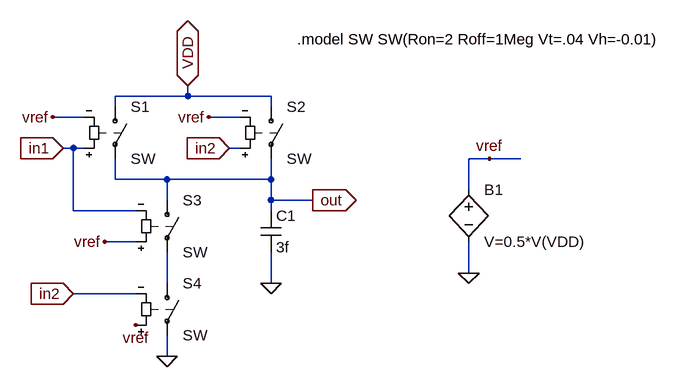
[diagram p0: schematic or2.asc]
or2.asc, the LTspice schematic file:
Version 4
SHEET 1 1084 680
WIRE 256 64 256 48
WIRE 256 64 144 64
WIRE 384 64 256 64
WIRE 144 80 144 64
WIRE 384 80 384 64
WIRE 96 96 48 96
WIRE 336 96 288 96
WIRE 80 144 64 144
WIRE 96 144 80 144
WIRE 336 144 320 144
WIRE 720 160 688 160
WIRE 768 160 720 160
WIRE 144 192 144 160
WIRE 224 192 144 192
WIRE 384 192 384 160
WIRE 384 192 224 192
WIRE 688 208 688 160
WIRE 224 224 224 192
WIRE 384 224 384 192
WIRE 448 224 384 224
WIRE 80 240 80 144
WIRE 176 240 80 240
WIRE 384 240 384 224
WIRE 176 288 128 288
WIRE 688 336 688 288
WIRE 224 352 224 304
WIRE 384 352 384 304
WIRE 176 368 80 368
WIRE 224 464 224 432
FLAG 224 464 0
FLAG 64 144 in1
IOPIN 64 144 In
FLAG 80 368 in2
IOPIN 80 368 In
FLAG 320 144 in2
IOPIN 320 144 In
FLAG 256 48 VDD
IOPIN 256 48 BiDir
FLAG 448 224 out
IOPIN 448 224 Out
FLAG 720 160 vref
FLAG 688 336 0
FLAG 176 416 vref
FLAG 128 288 vref
FLAG 48 96 vref
FLAG 288 96 vref
FLAG 384 352 0
SYMBOL sw 144 64 R0
SYMATTR InstName S1
SYMBOL sw 384 64 R0
SYMATTR InstName S2
SYMBOL sw 224 208 R0
SYMATTR InstName S3
SYMBOL sw 224 336 R0
SYMATTR InstName S4
SYMBOL bv 688 192 R0
SYMATTR InstName B1
SYMATTR Value V=0.5*V(VDD)
SYMBOL cap 368 240 R0
SYMATTR InstName C1
SYMATTR Value 3f
TEXT 424 -24 Left 2 !.model SW SW(Ron=2 Roff=1Meg Vt=.04 Vh=-0.01)

The netlist it stands for:
* or2.asc
S1 VDD out in1 vref SW
S2 VDD out in2 vref SW
S3 out N001 vref in1 SW
S4 N001 0 vref in2 SW
B1 vref 0 V=0.5*V(VDD)
C1 out 0 3f
.model SW SW(Ron=2 Roff=1Meg Vt=.04 Vh=-0.01)
.backanno
.end